# Altium schematic sheet 分立功放电路原理图.SchDoc
size A3
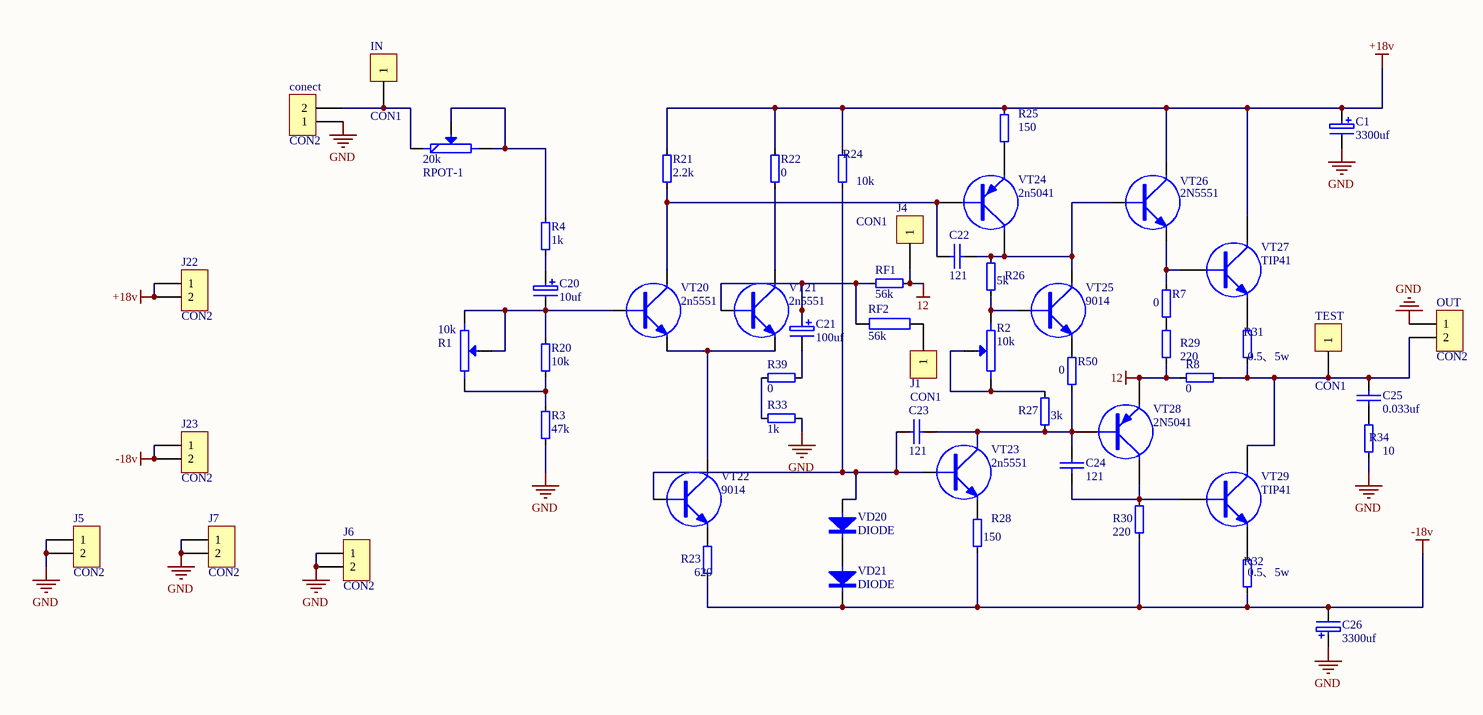
[diagram p0: 分立功放电路原理图.SchDoc]

## Parts
20k  RPOT-1  [RVR-A]
C1  3300uf  [C14]
C20  10uf  [CAO1]
C21  100uf  [CAO1]
C22  121  [RAD0.1]
C23  121  [RAD0.1]
C24  121  [RAD0.1]
C25  0.033uf  [RAD0.1]
C26  3300uf  [C14]
conect  CON2  [2P-200]
IN  CON1  [SIP-1]
J1  CON1  [SIP-1]
J4  CON1  [SIP-1]
J5  CON2  [sip-2]
J6  CON2  [2P-200]
J7  CON2  [sip-2]
J22  CON2  [2P-200]
J23  CON2  [2P-200]
OUT  CON2  [sip-2]
R1  10k  [RVR-4]
R2  10k  [RVR-4]
R3  47k  [AXIAL0.4]
R4  1k  [AXIAL0.4]
R7  0  [AXIAL0.4]
R8  0  [AXIAL0.4]
R20  10k  [AXIAL0.4]
R21  2.2k  [AXIAL0.4]
R22  0  [AXIAL0.4]
R23  620  [AXIAL0.4]
R24  10k  [AXIAL0.4]
R25  150  [AXIAL0.4]
R26  5k  [AXIAL0.4]
R27  3k  [AXIAL0.4]
R28  150  [AXIAL0.4]
R29  220  [AXIAL0.4]
R30  220  [AXIAL0.4]
R31  0.5、5w  [AXIAL1.0]
R32  0.5、5w  [AXIAL1.0]
R33  1k  [AXIAL0.4]
R34  10  [AXIAL0.4]
R39  0  [AXIAL0.4]
R50  0  [AXIAL0.4]
RF1  56k  [AXIAL0.4]
RF2  56k  [AXIAL0.4]
TEST  CON1  [SIP-1]
VD20  DIODE  [DIODE0.4]
VD21  DIODE  [DIODE0.4]
VT20  2n5551  [TO126V]
VT21  2n5551  [TO126V]
VT22  9014  [TO126V]
VT23  2n5551  [TO126V]
VT24  2n5041  [TO126V]
VT25  9014  [TO126V]
VT26  2N5551  [TO126V]
VT27  TIP41  [TO-220]
VT28  2N5041  [TO126V]
VT29  TIP41  [TO-220]

## Nets
12: J4.1 R8.1 R29.2 RF1.2 VT28.1(E)
+18v: C1.1 J22.1 J22.2 R21.1 R22.1 R24.1 R25.1 VT26.3(C) VT27.2(C)
-18v: C26.2 J23.1 J23.2 R23.2 R28.2 R30.2 R32.2 VD21.2
GND: C1.2 C26.1 conect.1 J5.1 J5.2 J6.1 J6.2 J7.1 J7.2 OUT.1 R3.2 R33.2 R34.2
Net20k_1: 20k.1 conect.2 IN.1
Net20k_2: 20k.2(M) 20k.3 R4.1
NetC20_1: C20.1 R4.2
NetC20_2: C20.2 R1.1 R1.2(W) R20.1 VT20.2(B)
NetC21_1: C21.1 RF1.1 RF2.1 VT21.2(B)
NetC21_2: C21.2 R39.2
NetC22_1: C22.1 R21.2 VT20.3(C) VT24.2(B)
NetC22_2: C22.2 R26.1 VT24.3(C) VT25.3(C) VT26.2(B)
NetC23_1: C23.1 R24.2 VD20.1 VT22.2(B) VT23.2(B)
NetC23_2: C23.2 C24.2 R27.2 R50.2 VT23.3(C) VT28.2(B)
NetC24_1: C24.1 R30.1 VT28.3(C) VT29.1(B)
NetC25_1: C25.1 R34.1
NetC25_2: C25.2 OUT.2 R8.2 R31.2 TEST.1 VT29.2(C)
NetJ1_1: J1.1 RF2.2
NetR1_3: R1.3 R3.1 R20.2
NetR2_1: R2.1 R2.2(W) R27.1
NetR2_3: R2.3 R26.2 VT25.2(B)
NetR7_1: R7.1 VT26.1(E) VT27.1(B)
NetR7_2: R7.2 R29.1
NetR22_2: R22.2 VT21.3(C)
NetR23_1: R23.1 VT22.1(E)
NetR25_2: R25.2 VT24.1(E)
NetR28_1: R28.1 VT23.1(E)
NetR31_1: R31.1 VT27.3(E)
NetR32_1: R32.1 VT29.3(E)
NetR33_1: R33.1 R39.1
NetR50_1: R50.1 VT25.1(E)
NetVD20_2: VD20.2 VD21.1
NetVT20_1: VT20.1(E) VT21.1(E) VT22.3(C)

## Library data of the parts
20k = RPOT-1: 普通电位器
C1 C20 C21 C26 = CAP3
C22-C25 = CAP
conect J5-J7 J22 J23 OUT = CON2: Connector
IN J1 J4 TEST = CON1: Connector
R1 R2 = RPOT-1: Potentiometer
R3 R4 R7 R8 R20-R34 R39 R50 RF1 = RES
RF2 = RES: 电阻
VT20 VT21 VT23 VT26 = 9014
VT24 VT28 = 9012
VT27 VT29 = TIP41: NPN PLASTIC POWER TRANSISTORS